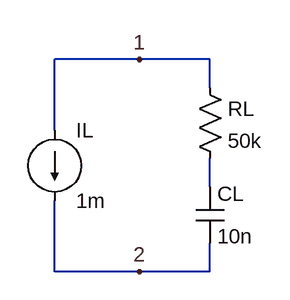
[diagram p0: schematic load.asc]
load.asc, the LTspice schematic file:
Version 4
SHEET 1 880 680
WIRE 256 32 160 32
WIRE 336 32 256 32
WIRE 336 64 336 32
WIRE 160 112 160 32
WIRE 336 176 336 144
WIRE 160 272 160 192
WIRE 256 272 160 272
WIRE 336 272 336 240
WIRE 336 272 256 272
FLAG 256 32 1
FLAG 256 272 2
SYMBOL current 160 112 R0
SYMATTR InstName IL
SYMATTR Value 1m
SYMBOL cap 320 176 R0
SYMATTR InstName CL
SYMATTR Value 10n
SYMBOL res 320 48 R0
SYMATTR InstName RL
SYMATTR Value 50k

The netlist it stands for:
* load.asc
IL 1 2 1m
CL N001 2 10n
RL 1 N001 50k
.backanno
.end